# Altium schematic sheet INCUBA 1.3.SchDoc
size A4; SheetNumber: 1; SheetTotal: 3
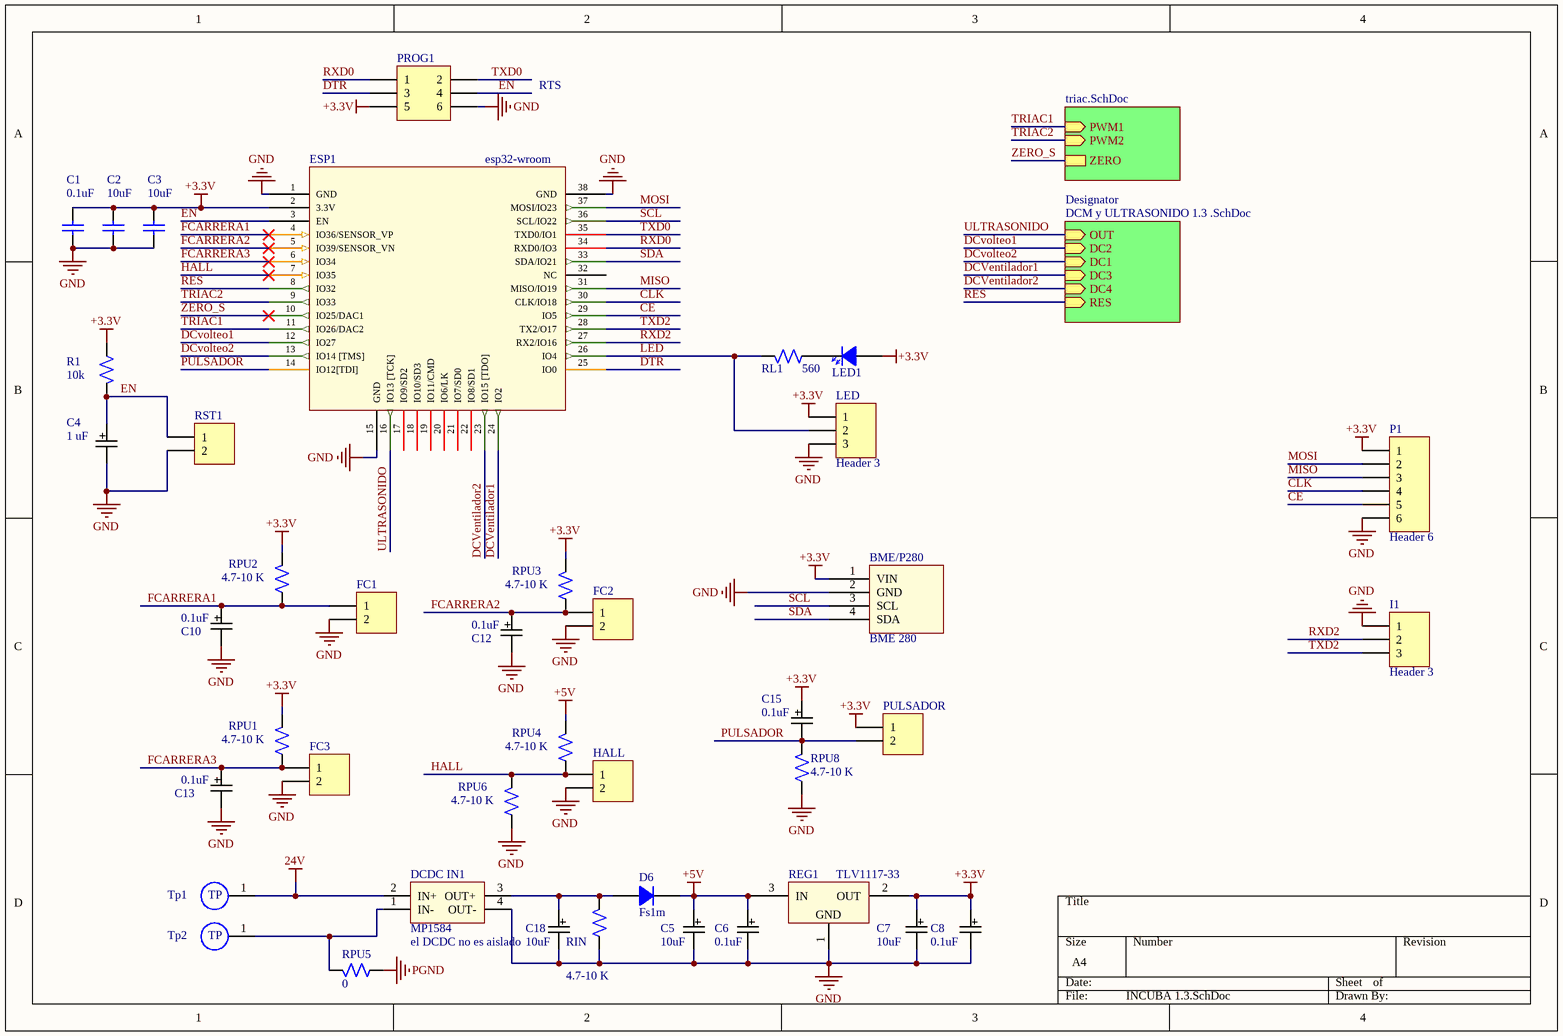
[diagram p0: INCUBA 1.3.SchDoc]

## Parts
BME/P280  BME 280  [bme280]
C1  value 0.1uF  [0805]
C2  value 10uF  [0805]
C3  value 10uF  [0805]
C4  value 1 uF  [0805]  (hidden comment: Capacitor)
C5  value 10uF  [0805]  (hidden comment: Capacitor)
C6  value 0.1uF  [0805]  (hidden comment: Capacitor)
C7  value 10uF  [0805]  (hidden comment: Capacitor)
C8  0.1uF  [0805]
C10  value 0.1uF  [0805]  (hidden comment: Capacitor)
C12  value 0.1uF  [0805]  (hidden comment: Capacitor)
C13  value 0.1uF  [0805]  (hidden comment: Capacitor)
C15  value 0.1uF  [0805]  (hidden comment: Capacitor)
C18  value 10uF  [0805]  (hidden comment: Capacitor)
D6  Fs1m  [DO-214AC]
DCDC_IN1  MP1584  [MP1584]
ESP1  esp32-wroom  [esp32-wroom - modificado - sinpad]
FC1  Header 2  [HDR1X2]  (value not drawn)
FC2  Header 2  [HDR1X2]  (value not drawn)
FC3  Header 2  [HDR1X2]  (value not drawn)
HALL  Header 2  [HDR1X2]  (value not drawn)
I1  Header 3  [HDR1X3]
LED  Header 3  [HDR1X3]
LED1  LED_SMD  [0805 - led]  (value not drawn)
P1  Header 6  [HDR1X6]
PROG1  Header 3X2  [HDR2X3]  (value not drawn)
PULSADOR  Header 2  [HDR1X2]  (value not drawn)
R1  value 10k  [0805]  (hidden comment: Resistencia)
REG1  TLV1117-33  [SOT-223-4]
RIN  value 4.7-10 K  [0805]  (hidden comment: Resistencia)
RL1  value 560  [0805]  (hidden comment: Resistencia)
RPU1  value 4.7-10 K  [0805]  (hidden comment: Resistencia)
RPU2  value 4.7-10 K  [0805]  (hidden comment: Resistencia)
RPU3  value 4.7-10 K  [0805]  (hidden comment: Resistencia)
RPU4  value 4.7-10 K  [0805]  (hidden comment: Resistencia)
RPU5  value 0  [0805]  (hidden comment: Resistencia)
RPU6  value 4.7-10 K  [0805]  (hidden comment: Resistencia)
RPU8  value 4.7-10 K  [0805]  (hidden comment: Resistencia)
RST1  Header 2  [HDR1X2]  (value not drawn)
Tp1  Testpoint  [Testpoint]  (value not drawn)
Tp2  Testpoint  [Testpoint]  (value not drawn)

## Sub-sheets
Designator = triac.SchDoc: PWM1 (in), PWM2 (in), ZERO
Designator = DCM y ULTRASONIDO 1.3 .SchDoc: OUT (in), DC2 (in), DC1 (in), DC3 (in), DC4 (in), RES (in)

## Nets
24V: DCDC_IN1.2(IN+) Tp1.1(TP)
+3.3V: BME/P280.1(VIN) C1.2 C2.2 C3.2 C7.2 C8.2 C15.2 ESP1.2(3.3V) LED.1 LED1.2(A) P1.1 PROG1.5 PULSADOR.1 R1.2 REG1.2(OUT) RPU1.2 RPU2.2 RPU3.2
+5V: C5.2 C6.2 D6.1(K) REG1.3(IN) RPU4.2
GND: BME/P280.2(GND) C1.1 C2.1 C3.1 C4.1 C5.1 C6.1 C7.1 C8.1 C10.1 C12.1 C13.1 C18.1 DCDC_IN1.4(OUT-) ESP1.1(GND) ESP1.15(GND) ESP1.38(GND) FC1.2 FC2.2 FC3.2 HALL.2 I1.1 LED.3 P1.6 PROG1.6 REG1.1(GND) RIN.1 RPU6.1 RPU8.1 RST1.2
PGND: RPU5.1
CE: ESP1.29(IO5) P1.5
CLK: ESP1.30(CLK/IO18) P1.4
DCVentilador1: ESP1.24(IO2) ; sheet Designator/DC3
DCVentilador2: ESP1.23(IO15_[TDO]) ; sheet Designator/DC4
DCvolteo1: ESP1.12(IO27) ; sheet Designator/DC2
DCvolteo2: ESP1.13(IO14_[TMS]) ; sheet Designator/DC1
DTR: ESP1.25(IO0) PROG1.3
EN: C4.2 ESP1.3(EN) PROG1.4 R1.1 RST1.1
FCARRERA1: C10.2 ESP1.4(IO36/SENSOR_VP) FC1.1 RPU2.1
FCARRERA2: C12.2 ESP1.5(IO39/SENSOR_VN) FC2.1 RPU3.1
FCARRERA3: C13.2 ESP1.6(IO34) FC3.1 RPU1.1
HALL: ESP1.7(IO35) HALL.1 RPU4.1 RPU6.2
LED: ESP1.26(IO4) LED.2 RL1.2
MISO: ESP1.31(MISO/IO19) P1.3
MOSI: ESP1.37(MOSI/IO23) P1.2
PULSADOR: C15.1 ESP1.14(IO12[TDI]) PULSADOR.2 RPU8.2
RES: ESP1.8(IO32) ; sheet Designator/RES
RXD0: ESP1.34(RXD0/IO3) PROG1.1
RXD2: ESP1.27(RX2/IO16) I1.2
SCL: BME/P280.3(SCL) ESP1.36(SCL/IO22)
SDA: BME/P280.4(SDA) ESP1.33(SDA/IO21)
TRIAC1: ESP1.11(IO26/DAC2) ; sheet Designator/PWM1
TRIAC2: ESP1.9(IO33) ; sheet Designator/PWM2
TXD0: ESP1.35(TXD0/IO1) PROG1.2
TXD2: ESP1.28(TX2/O17) I1.3
ULTRASONIDO: ESP1.16(IO13_[TCK]) ; sheet Designator/OUT
ZERO_S: ESP1.10(IO25/DAC1) ; sheet Designator/ZERO
NetC18_2: C18.2 D6.2(A) DCDC_IN1.3(OUT+) RIN.2
NetDCDC_IN1_1: DCDC_IN1.1(IN-) RPU5.2 Tp2.1(TP)
NetLED1_1: LED1.1(K) RL1.1

Not connected (* = marked no-connect by the designer): ESP1 17(IO9/SD2) 18(IO10/SD3) 19(IO11/CMD) 20(IO6/LK) 21(IO7/SD0) 22(IO8/SD1) 32(NC)

## Notes on the sheet
- RTS
- el DCDC no es aislado

## Library data of the parts
C1-C3 = Cap SMD: Capacitor; Published: 8-Jun-2000; LatestRevisionDate: 29-May-2009; LatestRevisionNote: IPC-7351 Footprint Added.; PackageReference: C0805; Publisher: Altium Limited; PackageDescription: Chip Capacitor
C7 = Capacitor: 100UFX6.3V 10%. B=3528 (1210) TAN.SMD AVX Codigo Elemon CA3388050
C8 = Capacitor
D6 = Diodo: DSK14 , US1M. Fs1m; Published: 8-Jun-2000; LatestRevisionDate: 17-Jul-2002; LatestRevisionNote: Re-released for DXP Platform.; PackageDocument: Sep-1996; PackageReference: SMC; Publisher: Altium Limited; Code_JEDEC: DO-214-AB
FC1-FC3 HALL PULSADOR RST1 = Header 2: Header, 2-Pin; LatestRevisionDate: 17-Jul-2002; LatestRevisionNote: Re-released for DXP Platform.; Publisher: Altium Limited
I1 LED = Header 3: Header, 3-Pin; LatestRevisionDate: 17-Jul-2002; LatestRevisionNote: Re-released for DXP Platform.; Publisher: Altium Limited
LED1 = LED_SMD: Luminic signal diode; Published: 8-Jun-2000; LatestRevisionDate: 17-Jul-2002; LatestRevisionNote: Re-released for DXP Platform.; PackageDocument: Sep-1996; PackageReference: SMC; Publisher: Altium Limited; Code_JEDEC: DO-214-AB
P1 = Header 6: Header, 6-Pin; LatestRevisionDate: 17-Jul-2002; LatestRevisionNote: Re-released for DXP Platform.; Publisher: Altium Limited
PROG1 = Header 3X2: Header, 3-Pin, Dual row; System: Connector; LatestRevisionDate: 17-Jul-2002; LatestRevisionNote: Re-released for DXP Platform.; Publisher: Altium Limited
R1 RIN RL1 RPU1-RPU6 RPU8 = Resistencia: Resistencia  de con varios Footprint
Tp1 Tp2 = Testpoint: Tespoint